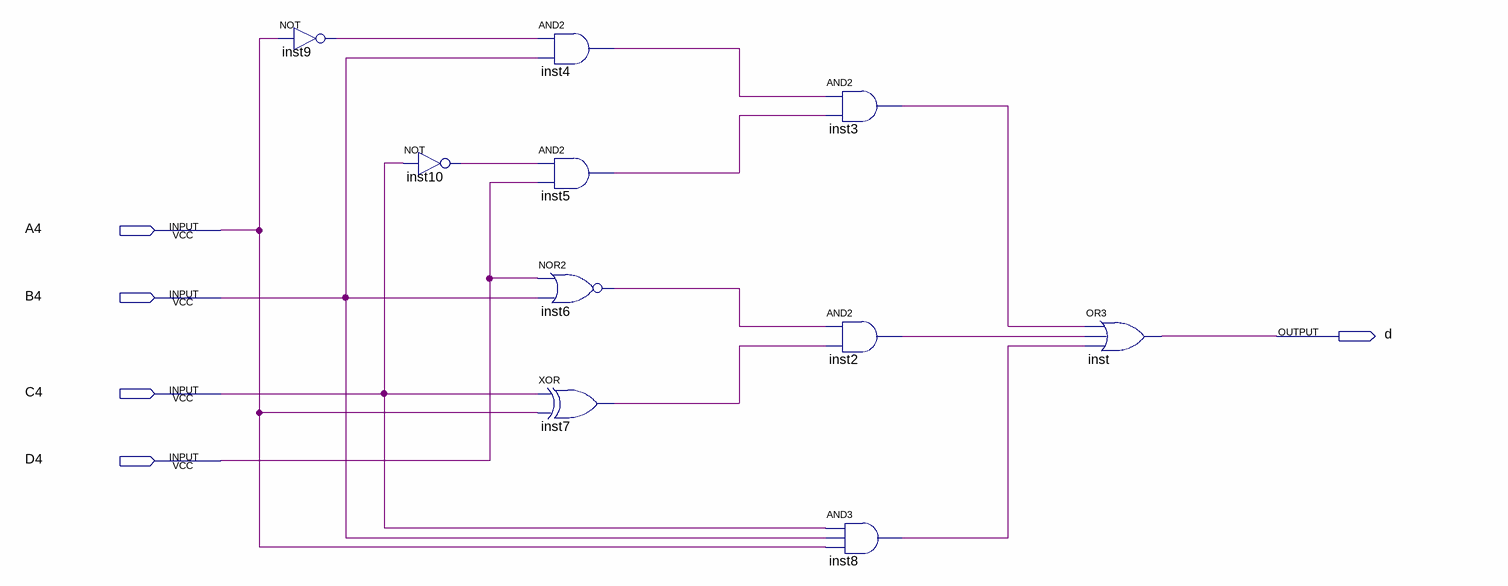
[diagram p0: schematic sheet]
// Quartus schematic Segment_d.bdf as structural Verilog: 10 symbols, 5 pins
module Segment_d (
  input  A4,
  input  B4,
  input  C4,
  input  D4,
  output d
);

  wire inst2_out, inst3_out, inst4_out, inst5_out, inst6_out, inst7_out, inst8_out, inst9_out, inst10_out;

  not inst9 (inst9_out, A4);
  not inst10 (inst10_out, C4);
  and inst4 (inst4_out, inst9_out, B4);
  and inst5 (inst5_out, inst10_out, D4);
  nor inst6 (inst6_out, D4, B4);
  xor inst7 (inst7_out, C4, A4);
  and inst3 (inst3_out, inst4_out, inst5_out);
  and inst2 (inst2_out, inst6_out, inst7_out);
  and inst8 (inst8_out, C4, B4, A4);
  or inst (d, inst3_out, inst2_out, inst8_out);
endmodule
